# Altium project Filtros.PrjPcb
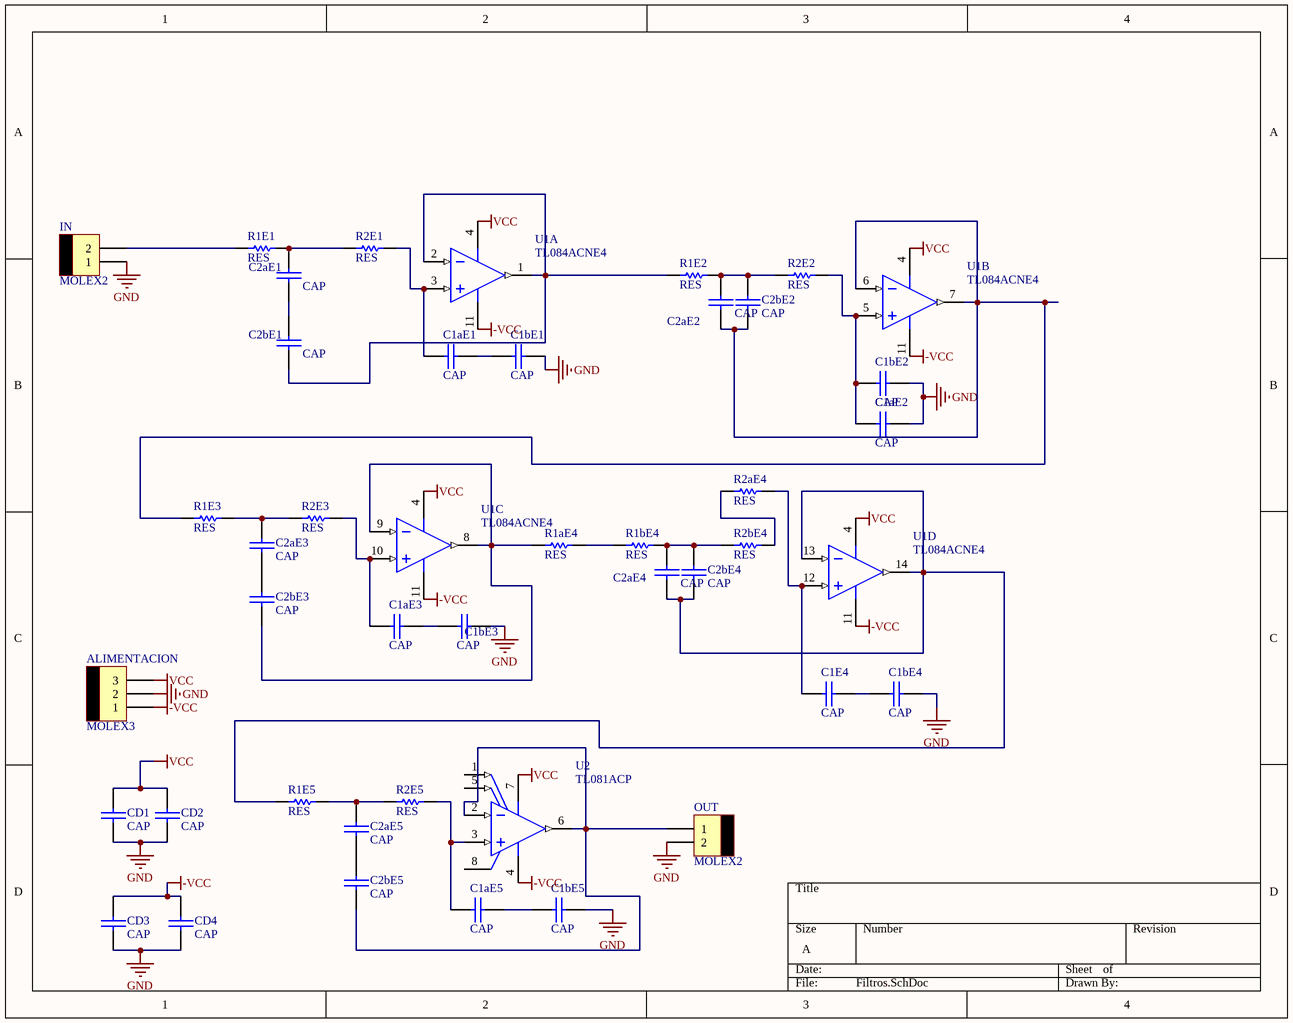
[diagram p0: Filtros.SchDoc]
1 sheet, 41 parts. Net scope: global (net labels, ports and power ports of the same name join across sheets).
Board file: FILTROS.PcbDoc

## Sheet Filtros.SchDoc
size A

### Parts
ALIMENTACION  MOLEX3  [MOLEX3]
C1aE1  CAP  [0805]
C1aE2  CAP  [0805]
C1aE3  CAP  [0805]
C1aE5  CAP  [0805]
C1bE1  CAP  [0805]
C1bE2  CAP  [0805]
C1bE3  CAP  [0805]
C1bE4  CAP  [0805]
C1bE5  CAP  [0805]
C1E4  CAP  [0805]
C2aE1  CAP  [0805]
C2aE2  CAP  [0805]
C2aE3  CAP  [0805]
C2aE4  CAP  [0805]
C2aE5  CAP  [0805]
C2bE1  CAP  [0805]
C2bE2  CAP  [0805]
C2bE3  CAP  [0805]
C2bE4  CAP  [0805]
C2bE5  CAP  [0805]
CD1  CAP  [0805]
CD2  CAP  [0805]
CD3  CAP  [0805]
CD4  CAP  [0805]
IN  MOLEX2  [MOLEX2]
OUT  MOLEX2  [MOLEX2]
R1aE4  RES  [0805]
R1bE4  RES  [0805]
R1E1  RES  [0805]
R1E2  RES  [0805]
R1E3  RES  [0805]
R1E5  RES  [0805]
R2aE4  RES  [0805]
R2bE4  RES  [0805]
R2E1  RES  [0805]
R2E2  RES  [0805]
R2E3  RES  [0805]
R2E5  RES  [0805]
U1  TL084ACNE4  [TI-N14]  (parts A,B,C,D of 4)
U2  TL081ACP  [TI-P8]

### Nets
-VCC: ALIMENTACION.1 CD3.1 CD4.1 U1.11(VCC-) U2.4(VCC-)
GND: ALIMENTACION.2 C1aE2.2 C1bE1.2 C1bE2.2 C1bE3.2 C1bE4.2 C1bE5.2 CD1.2 CD2.2 CD3.2 CD4.2 IN.1 OUT.2
VCC: ALIMENTACION.3 CD1.1 CD2.1 U1.4(VCC+) U2.7(VCC+)
NetC1aE1_1: C1aE1.1 R2E1.2 U1.3(IN1+)
NetC1aE1_2: C1aE1.2 C1bE1.1
NetC1aE2_1: C1aE2.1 C1bE2.1 R2E2.2 U1.5(IN2+)
NetC1aE3_1: C1aE3.1 R2E3.2 U1.10(IN3+)
NetC1aE3_2: C1aE3.2 C1bE3.1
NetC1aE5_1: C1aE5.1 R2E5.2 U2.3(IN+)
NetC1aE5_2: C1aE5.2 C1bE5.1
NetC1bE4_1: C1bE4.1 C1E4.2
NetC1E4_1: C1E4.1 R2aE4.2 U1.12(IN4+)
NetC2aE1_1: C2aE1.1 R1E1.2 R2E1.1
NetC2aE1_2: C2aE1.2 C2bE1.1
NetC2aE2_1: C2aE2.1 C2bE2.1 R1E2.2 R2E2.1
NetC2aE2_2: C2aE2.2 C2bE2.2 R1E3.1 U1.6(IN2-) U1.7(OUT2)
NetC2aE3_1: C2aE3.1 R1E3.2 R2E3.1
NetC2aE3_2: C2aE3.2 C2bE3.1
NetC2aE4_1: C2aE4.1 C2bE4.1 R1bE4.2 R2bE4.1
NetC2aE4_2: C2aE4.2 C2bE4.2 R1E5.1 U1.13(IN4-) U1.14(OUT4)
NetC2aE5_1: C2aE5.1 R1E5.2 R2E5.1
NetC2aE5_2: C2aE5.2 C2bE5.1
NetC2bE1_2: C2bE1.2 R1E2.1 U1.1(OUT1) U1.2(IN1-)
NetC2bE3_2: C2bE3.2 R1aE4.1 U1.8(OUT3) U1.9(IN3-)
NetC2bE5_2: C2bE5.2 OUT.1 U2.2(IN-) U2.6(OUT)
NetIN_2: IN.2 R1E1.1
NetR1aE4_2: R1aE4.2 R1bE4.1
NetR2aE4_1: R2aE4.1 R2bE4.2

Not connected (* = marked no-connect by the designer): U2 1(OFFSET_N1) 5(OFFSET_N2) 8(NC)

### Library data of the parts
U1 = TL084ACNE4: JFET-Input Operational Amplifier, 7 to 36 V, 0 to 70 degC, 14-pin DIP (N14), Pb-Free (RoHS); Manufacturer: Texas Instruments; CMRR(Min)(dB): 75; GBW(Typ)(MHz): 3; IIB(Max)(pA): 200; Iq per channel(Max)(mA): 2.8; Number of Channels: 4; Offset Drift(Typ)(uV/C): 18; Rating: Catalog; Slew Rate(Typ)(V/us): 13; Sub Family: General Purpose Amplifier, High Supply Voltage Amplifier (>=30V); Total Supply Voltage(Max)(+5V is 5, +/-5V is 10): 36; Total Supply Voltage(Min)(+5V is 5, +/-5V is 10): 7; Vio (25C)(Max)(mV): 6; DatasheetVersion: SLOS081G; PackageVersion: 4040049/E, 12/2002; PackageReference: N14; PackageDescription: 14-Pin Plastic In-Line, Body 19.305 x 6.35 mm, Pitch 2.54 mm; Supplier 1: Digi-Key; Supplier Part Number 1: TL084ACNE4-ND; Supplier 2: Mouser; Supplier Part Number 2: 595-TL084ACNE4; Eco-Plan: Pb-Free (RoHS); Vn at 1kHz(Typ)(nV/rtHz): 18; Mounting Technology: Through Hole; Code_JEDEC: MS-001; PartNumber: TL084ACNE4; ComponentLink1Description: Manufacturer URL; ComponentLink1URL: http://www.ti.com/; ComponentLink2Description: Datasheet; ComponentLink2URL: http://www.ti.com/lit/ds/symlink/tl084a.pdf; ComponentLink3Description: Package Specification; ComponentLink3URL: http://www.ti.com/lit/ml/mpdi002c/mpdi002c.pdf
U2 = TL081ACP: JFET-Input Operational Amplifier, 7 to 36 V, 0 to 70 degC, 8-pin DIP (P8), Pb-Free (RoHS); Manufacturer: Texas Instruments; CMRR(Min)(dB): 75; GBW(Typ)(MHz): 3; IIB(Max)(pA): 200; Iq per channel(Max)(mA): 2.8; Number of Channels: 1; Offset Drift(Typ)(uV/C): 18; Rating: Catalog; Slew Rate(Typ)(V/us): 13; Sub Family: General Purpose Amplifier, High Supply Voltage Amplifier (>=30V); Total Supply Voltage(Max)(+5V is 5, +/-5V is 10): 36; Total Supply Voltage(Min)(+5V is 5, +/-5V is 10): 7; Vio (25C)(Max)(mV): 6; DatasheetVersion: SLOS081G; PackageVersion: 4040082/E, 04/2010; PackageReference: P8; PackageDescription: 8-Pin Plastic In-Line, Body 9.59 x 6.35 mm, Pitch 2.54 mm; Supplier 1: Digi-Key; Supplier Part Number 1: 296-7202-5-ND; Supplier 2: Farnell; Supplier Part Number 2: 1133073; Supplier 3: Newark; Supplier Part Number 3: 68K1132; Supplier 4: Mouser; Supplier Part Number 4: 595-TL081ACP; Eco-Plan: Pb-Free (RoHS); Vn at 1kHz(Typ)(nV/rtHz): 18; Mounting Technology: Through Hole; Code_JEDEC: MS-001; PartNumber: TL081ACP; ComponentLink1Description: Manufacturer URL; ComponentLink1URL: http://www.ti.com/; ComponentLink2Description: Datasheet; ComponentLink2URL: http://www.ti.com/lit/ds/symlink/tl081a.pdf; ComponentLink3Description: Package Specification; ComponentLink3URL: http://www.ti.com/litv/pdf/mpdi001b